# EAGLE board Flexboard (EAGLE 9.7.0), part 1 of 3
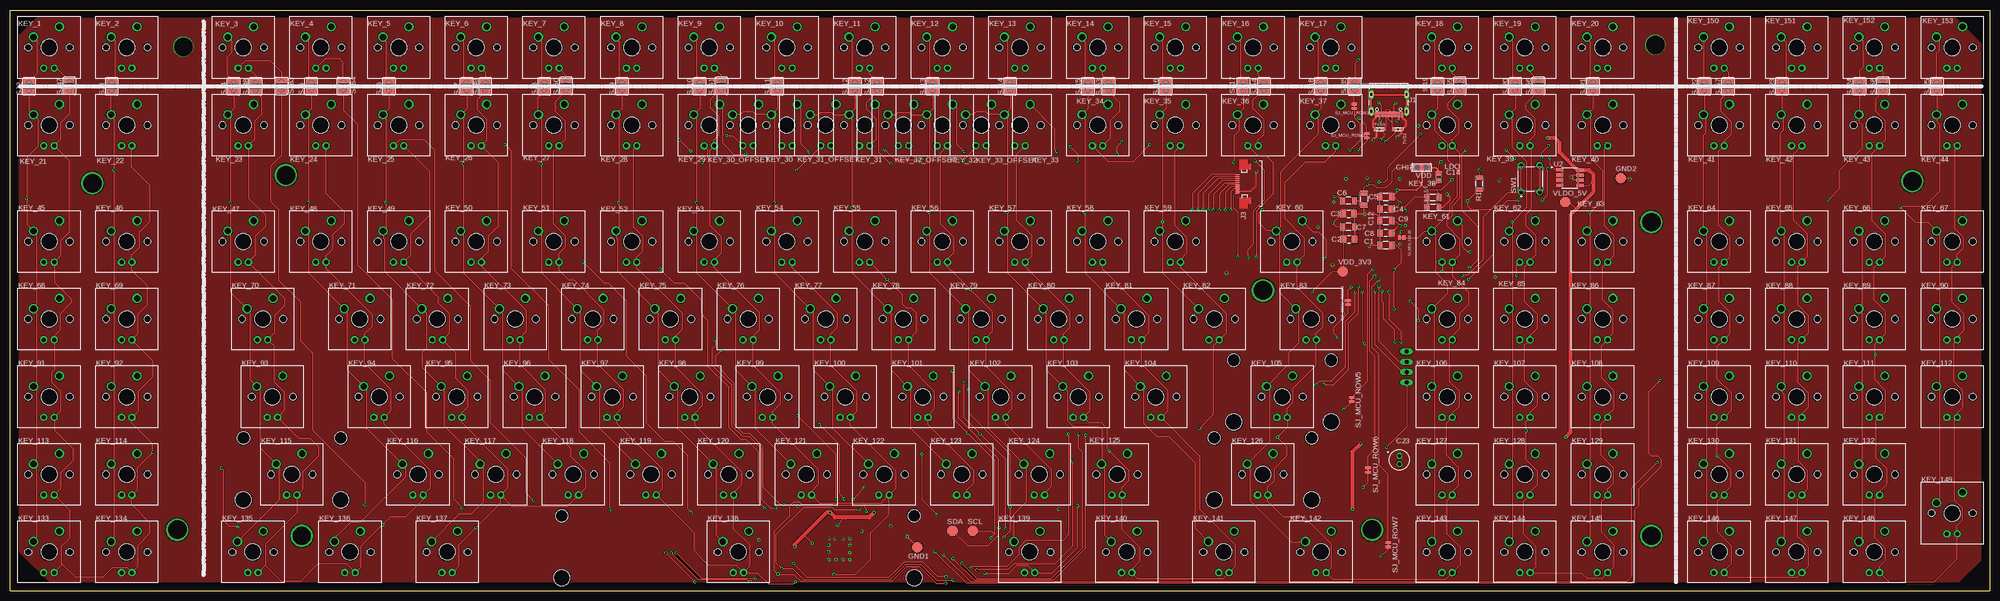
[diagram p6: board, top side]
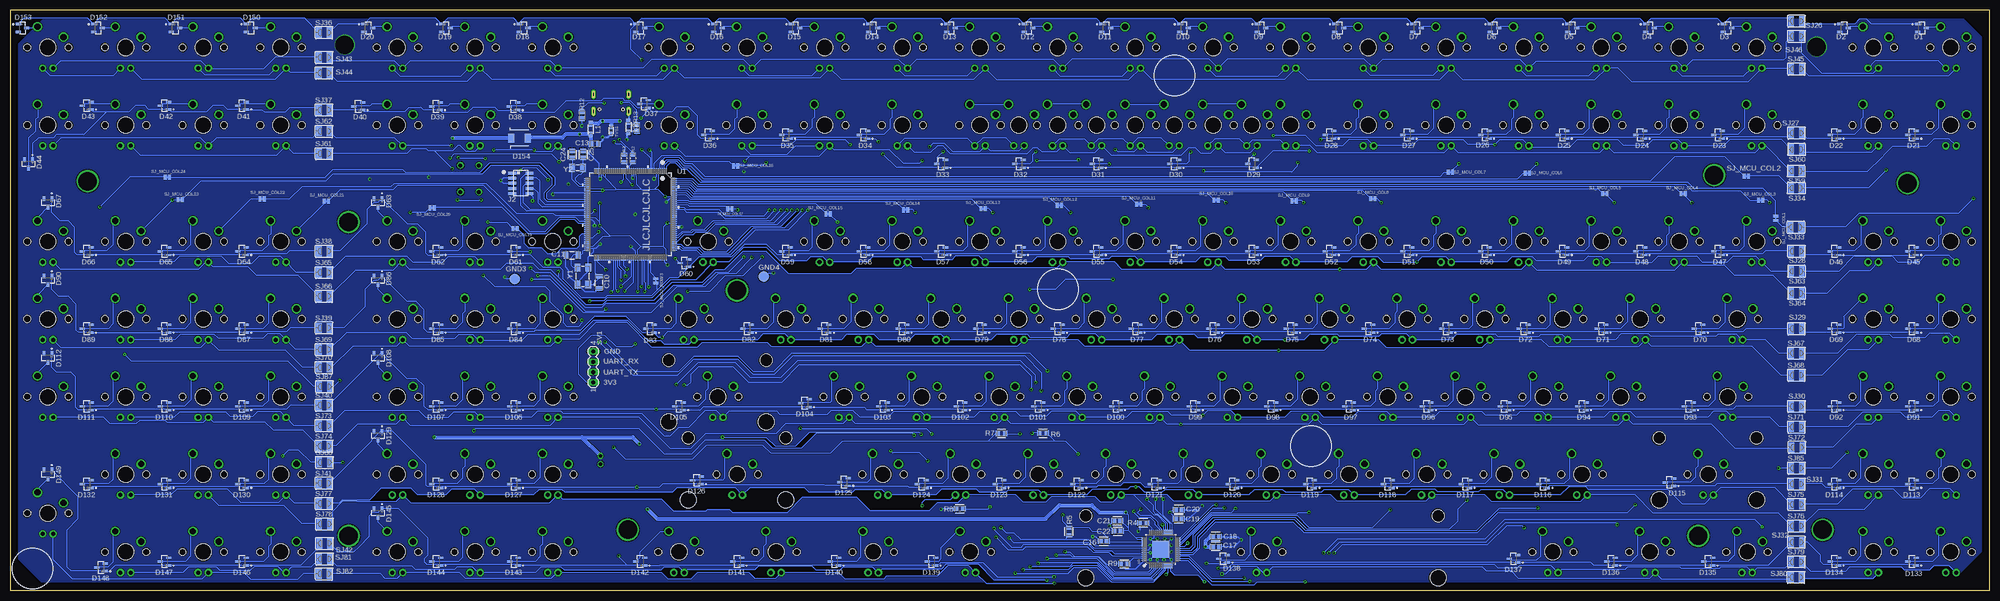
[diagram p7: board, bottom side, seen from below]

Size 485.5 x 142.5 mm. Coordinates in mm from the lower left corner, seen from the top.
Outline: 0,0 485.5,0 485.5,142.5 0,142.5 0,0
Copper layers (1*16): Top 0.035mm / dielectric 1.6mm / Bottom 0.035mm
Design rules "jlcpcb-2layers *": minimum track width 5mil, minimum drill 0.3mm, track to track 5mil, track to pad 0.2mm, pad to pad 0.5mm, via to via 0.5mm, smd to smd 5mil, copper to edge 10mil, drill to drill 6mil, minimum pad ring 0.3mm, minimum via ring 0.2mm, stop-mask expansion 4mil, vias tented up to drill 0mil, thermal gap 10mil
Holes 3.05 mm at 319.2,37.5 295.3,37.5 324,56.6 300.1,56.6 81.1,37.5 57.2,37.5 221.7,18.4 135.3,18.4
Holes 3.99 mm at 319.2,22.3 295.3,22.3 324,41.4 300.1,41.4 81.1,22.3 57.2,22.3 221.7,3.2 135.3,3.2

## Footprints (pad centres in the part's own frame; a part is rotated, then mirrored left to right if it is on the bottom)
CAPC3216X110N = smd 1.16 x 1.82: 1 -1.475,0; 2 1.475,0
CAPC3216X125N = smd 1.38 x 1.82: 1 -1.369,0; 2 1.369,0
CAPC3216X88N = smd 1.16 x 1.82: 1 -1.475,0; 2 1.475,0
CAPC3216X178N = smd 1.16 x 1.82: 1 -1.475,0; 2 1.475,0
CAPC2012X145N = smd 1.11 x 1.47: 1 -0.9,0; 2 0.9,0
CAPC2012X110 = smd 1.165 x 1.465: 1 -0.875,0; 2 0.875,0
860020672011 = drill 0.8 octagon: + 0,1; - 0,-1
SOT95P240X111-3N = smd 1.23 x 0.6: 1 -1.06,0.95; 2 -1.06,-0.95; 3 1.06,0
LSM115JE3/TR13 = smd 1.52 x 2.21: 1 -2.035,0; 2 2.035,0
B2,54 = smd 2.54 x 2.54: TP 0,0
PTH = drill 4.5 pad 5.2: HOLE 0,0
GCT_USB4105-GF-A = smd 0.6 x 1.25: A1_B12 -3.2,4.905; B1_A12 3.2,4.905 | smd 0.6 x 1.35: A4_B9 -2.4,4.855; B4_A9 2.4,4.855 | smd 0.3 x 1.35: A5 -1.25,4.855; A6 -0.25,4.855; A7 0.25,4.855; A8 1.25,4.855; B5 1.75,4.855; B6 0.75,4.855; B7 -0.75,4.855; B8 -1.75,4.855 | drill 0.66 pad 1.05 long: S1 -4.32,4.18; S4 4.32,4.18 | drill 0.66 pad 1 long: S2 -4.32,0; S3 4.32,0 | hole 0.65: 2.89,3.68; -2.89,3.68
DEBUG = smd 1.854 x 0.737: 1 -2.121,2.54; 2 2.121,2.54; 3 -2.121,1.27; 4 2.121,1.27; 5 -2.121,0; 6 2.121,0; 7 -2.121,-1.27; 8 2.121,-1.27; 9 -2.121,-2.54; 10 2.121,-2.54
52745-1033 = smd 0.3 x 0.8: 1 -2.25,0; 2 -1.75,0; 3 -1.25,0; 4 -0.75,0; 5 -0.25,0; 6 0.25,0; 7 0.75,0; 8 1.25,0; 9 1.75,0; 10 2.25,0
CHERRY-MX-LED = drill 0.991 pad 1.778: LED+ -1.27,-5.08; LED- 1.27,-5.08 | drill 1.499 pad 2.286: SW1 -3.81,2.54; SW2 2.54,5.08 | hole 3.988: 0,0 | hole 1.702: -5.08,0; 5.08,0
CHERRY-MX-LED-NOPIN = drill 1.016 pad 1.702: LED+ -1.27,-5.08; LED- 1.27,-5.08 | drill 1.499 pad 2.286: SW1 -3.81,2.54; SW2 2.54,5.08 | hole 3.988: 0,0
78285333 = smd 1.4 x 1: 1 -1.3,0; 2 1.3,0
RESC3115X65N = smd 1.05 x 1.72: 1 -1.46,0; 2 1.46,0
RESC2012X65N = smd 1 x 1.42: 1 -0.935,0; 2 0.935,0
RESC2012X65 = smd 1.031 x 1.42: 1 -0.919,0; 2 0.919,0
RESC2012X60N = smd 1.2 x 1.42: 1 -0.835,0; 2 0.835,0
SJ_2 = smd 1.168 x 1.6: 1 -1.524,0; 2 0,0; 3 1.524,0
SJW = smd 1.27 x 2.54: 1 -1.27,0; 2 1.27,0
SMT-JUMPER_2_NC_TRACE_NO-SILK = smd 0.66 x 1.27: 1 -0.521,0; 2 0.521,0
MA04-1 = drill 1.016 long: 1 -3.81,0; 2 -1.27,0; 3 1.27,0; 4 3.81,0
SW_1825910-7 = drill 0.99: 1 -3.25,2.25; 2 3.25,2.25; 3 -3.25,-2.25; 4 3.25,-2.25
0603ESDA2-TR2 = smd 1.1 x 1: 1 -0.85,0; 2 0.85,0
LQFP-144_20X20X1.6 = smd 1.461 x 0.27: 1 -10.498,8.75; 2 -10.498,8.25; 3 -10.498,7.75; 4 -10.498,7.25; 5 -10.498,6.75; 6 -10.498,6.25; 7 -10.498,5.75; 8 -10.498,5.25; 9 -10.498,4.75; 10 -10.498,4.25; 11 -10.498,3.75; 12 -10.498,3.25; 13 -10.498,2.75; 14 -10.498,2.25; 15 -10.498,1.75; 16 -10.498,1.25; 17 -10.498,0.75; 18 -10.498,0.25; 19 -10.498,-0.25; 20 -10.498,-0.75; 21 -10.498,-1.25; 22 -10.498,-1.75; 23 -10.498,-2.25; 24 -10.498,-2.75; 25 -10.498,-3.25; 26 -10.498,-3.75; 27 -10.498,-4.25; 28 -10.498,-4.75; 29 -10.498,-5.25; 30 -10.498,-5.75; 31 -10.498,-6.25; 32 -10.498,-6.75; 33 -10.498,-7.25; 34 -10.498,-7.75; 35 -10.498,-8.25; 36 -10.498,-8.75; 73 10.752,-8.75; 74 10.752,-8.25; 75 10.752,-7.75; 76 10.752,-7.25; 77 10.752,-6.75; 78 10.752,-6.25; 79 10.752,-5.75; 80 10.752,-5.25; 81 10.752,-4.75; 82 10.752,-4.25; 83 10.752,-3.75; 84 10.752,-3.25; 85 10.752,-2.75; 86 10.752,-2.25; 87 10.752,-1.75; 88 10.752,-1.25; 89 10.752,-0.75; 90 10.752,-0.25; 91 10.752,0.25; 92 10.752,0.75; 93 10.752,1.25; 94 10.752,1.75; 95 10.752,2.25; 96 10.752,2.75; 97 10.752,3.25; 98 10.752,3.75; 99 10.752,4.25; 100 10.752,4.75; 101 10.752,5.25; 102 10.752,5.75; 103 10.752,6.25; 104 10.752,6.75; 105 10.752,7.25; 106 10.752,7.75; 107 10.752,8.25; 108 10.752,8.75 | smd 0.27 x 1.461: 37 -8.623,-10.625; 38 -8.123,-10.625; 39 -7.623,-10.625; 40 -7.123,-10.625; 41 -6.623,-10.625; 42 -6.123,-10.625; 43 -5.623,-10.625; 44 -5.123,-10.625; 45 -4.623,-10.625; 46 -4.123,-10.625; 47 -3.623,-10.625; 48 -3.123,-10.625; 49 -2.623,-10.625; 50 -2.123,-10.625; 51 -1.623,-10.625; 52 -1.123,-10.625; 53 -0.623,-10.625; 54 -0.123,-10.625; 55 0.377,-10.625; 56 0.877,-10.625; 57 1.377,-10.625; 58 1.877,-10.625; 59 2.377,-10.625; 60 2.877,-10.625; 61 3.377,-10.625; 62 3.877,-10.625; 63 4.377,-10.625; 64 4.877,-10.625; 65 5.377,-10.625; 66 5.877,-10.625; 67 6.377,-10.625; 68 6.877,-10.625; 69 7.377,-10.625; 70 7.877,-10.625; 71 8.377,-10.625; 72 8.877,-10.625; 109 8.877,10.625; 110 8.377,10.625; 111 7.877,10.625; 112 7.377,10.625; 113 6.877,10.625; 114 6.377,10.625; 115 5.877,10.625; 116 5.377,10.625; 117 4.877,10.625; 118 4.377,10.625; 119 3.877,10.625; 120 3.377,10.625; 121 2.877,10.625; 122 2.377,10.625; 123 1.877,10.625; 124 1.377,10.625; 125 0.877,10.625; 126 0.377,10.625; 127 -0.123,10.625; 128 -0.623,10.625; 129 -1.123,10.625; 130 -1.623,10.625; 131 -2.123,10.625; 132 -2.623,10.625; 133 -3.123,10.625; 134 -3.623,10.625; 135 -4.123,10.625; 136 -4.623,10.625; 137 -5.123,10.625; 138 -5.623,10.625; 139 -6.123,10.625; 140 -6.623,10.625; 141 -7.123,10.625; 142 -7.623,10.625; 143 -8.123,10.625; 144 -8.623,10.625
SOIC127P600X175-8N = smd 1.95 x 0.59: 1 -2.48,1.905; 2 -2.48,0.635; 3 -2.48,-0.635; 4 -2.48,-1.905; 5 2.48,-1.905; 6 2.48,-0.635; 7 2.48,0.635; 8 2.48,1.905
IS31FL3733B-TQLS4 = smd 1.17 x 0.3: 1 -4.12,2.75; 2 -4.12,2.25; 3 -4.12,1.75; 4 -4.12,1.25; 5 -4.12,0.75; 6 -4.12,0.25; 7 -4.12,-0.25; 8 -4.12,-0.75; 9 -4.12,-1.25; 10 -4.12,-1.75; 11 -4.12,-2.25; 12 -4.12,-2.75; 25 4.12,-2.75; 26 4.12,-2.25; 27 4.12,-1.75; 28 4.12,-1.25; 29 4.12,-0.75; 30 4.12,-0.25; 31 4.12,0.25; 32 4.12,0.75; 33 4.12,1.25; 34 4.12,1.75; 35 4.12,2.25; 36 4.12,2.75 | smd 0.3 x 1.17: 13 -2.75,-4.12; 14 -2.25,-4.12; 15 -1.75,-4.12; 16 -1.25,-4.12; 17 -0.75,-4.12; 18 -0.25,-4.12; 19 0.25,-4.12; 20 0.75,-4.12; 21 1.25,-4.12; 22 1.75,-4.12; 23 2.25,-4.12; 24 2.75,-4.12; 37 2.75,4.12; 38 2.25,4.12; 39 1.75,4.12; 40 1.25,4.12; 41 0.75,4.12; 42 0.25,4.12; 43 -0.25,4.12; 44 -0.75,4.12; 45 -1.25,4.12; 46 -1.75,4.12; 47 -2.25,4.12; 48 -2.75,4.12 | smd 4.11 x 4.11: PAD 0,0
OSC_ABM3B-8.000MHZ-B2-T = smd 1.4 x 2: 1 -1.3,2.1; 2 -1.3,-2.1; 3 1.3,-2.1; 4 1.3,2.1
XTAL_ABS07-32.768KHZ-T = smd 1.3 x 2.1: 1 -1.35,0; 2 1.35,0

## Placement (x,y rotation side)
C1  1000pF  [CAPC3216X110N]  337.36,84.83 180 top
C2  1uF  [CAPC3216X125N]  328.34,86.29 0 top
C3  1uF  [CAPC3216X125N]  328.24,92.55 0 top
C4  1uF  [CAPC3216X125N]  337.36,93.74 180 top
C5  100nF  [CAPC3216X88N]  337.36,96.71 0 top
C6  100nF  [CAPC3216X88N]  328.23,95.75 180 top
C7  100nF  [CAPC3216X88N]  328.24,89.31 180 top
C8  1uF  [CAPC3216X125N]  337.36,87.79 180 top
C9  100nF  [CAPC3216X88N]  337.36,90.76 0 top
C10  22pF  [CAPC3216X110N]  341.12,75.7 90 bottom
C11  22pF  [CAPC3216X110N]  347.69,82.35 0 bottom
C12  2.2uF  [CAPC3216X178N]  332.01,96.14 270 top
C13  10uF  [CAPC2012X145N]  342.12,109.61 0 bottom
C14  10uF  [CAPC2012X145N]  350.41,101.53 270 top
C15  1000pF  [CAPC3216X110N]  348.96,94.05 0 top
C16  0.47uF  [CAPC2012X110]  217.3,12.2 180 bottom
C17  0.47uF  [CAPC2012X110]  189.8,10.8 0 bottom
C18  0.1uF  [CAPC2012X110]  189.8,13.3 0 bottom
C19  0.47uF  [CAPC2012X110]  198.9,17.6 0 bottom
C20  0.1uF  [CAPC2012X110]  198.9,19.9 0 bottom
C21  0.47uF  [CAPC2012X110]  214,17.2 180 bottom
C22  0.1uF  [CAPC2012X110]  213.9,14.7 180 bottom
C23  22uF  [860020672011]  340.7,32.1 0 top
C24  12pF  [CAPC2012X110]  347.7,107.1 90 bottom
C25  12pF  [CAPC2012X110]  344.99,107.1 90 bottom
D1  BAS16LT3G  [SOT95P240X111-3N]  16.67,138.11 0 bottom
D2  BAS16LT3G  [SOT95P240X111-3N]  35.72,138.11 0 bottom
D3  BAS16LT3G  [SOT95P240X111-3N]  64.29,138.11 0 bottom
D4  BAS16LT3G  [SOT95P240X111-3N]  83.34,138.11 0 bottom
D5  BAS16LT3G  [SOT95P240X111-3N]  102.39,138.11 0 bottom
D6  BAS16LT3G  [SOT95P240X111-3N]  121.44,138.11 0 bottom
D7  BAS16LT3G  [SOT95P240X111-3N]  140.49,138.11 0 bottom
D8  BAS16LT3G  [SOT95P240X111-3N]  159.54,138.11 0 bottom
D9  BAS16LT3G  [SOT95P240X111-3N]  178.59,138.11 0 bottom
D10  BAS16LT3G  [SOT95P240X111-3N]  197.64,138.11 0 bottom
D11  BAS16LT3G  [SOT95P240X111-3N]  216.69,138.11 0 bottom
D12  BAS16LT3G  [SOT95P240X111-3N]  235.74,138.11 0 bottom
D13  BAS16LT3G  [SOT95P240X111-3N]  254.79,138.11 0 bottom
D14  BAS16LT3G  [SOT95P240X111-3N]  273.84,138.11 0 bottom
D15  BAS16LT3G  [SOT95P240X111-3N]  292.89,138.11 0 bottom
D16  BAS16LT3G  [SOT95P240X111-3N]  311.94,138.11 0 bottom
D17  BAS16LT3G  [SOT95P240X111-3N]  330.99,138.11 0 bottom
D18  BAS16LT3G  [SOT95P240X111-3N]  359.57,138.11 0 bottom
D19  BAS16LT3G  [SOT95P240X111-3N]  378.62,138.11 0 bottom
D20  BAS16LT3G  [SOT95P240X111-3N]  397.67,138.11 0 bottom
D21  BAS16LT3G  [SOT95P240X111-3N]  19.05,111.92 180 bottom
D22  BAS16LT3G  [SOT95P240X111-3N]  38.1,111.92 180 bottom
D23  BAS16LT3G  [SOT95P240X111-3N]  66.67,111.92 180 bottom
D24  BAS16LT3G  [SOT95P240X111-3N]  85.72,111.92 180 bottom
D25  BAS16LT3G  [SOT95P240X111-3N]  104.78,111.92 180 bottom
D26  BAS16LT3G  [SOT95P240X111-3N]  123.83,111.92 180 bottom
D27  BAS16LT3G  [SOT95P240X111-3N]  142.88,111.92 180 bottom
D28  BAS16LT3G  [SOT95P240X111-3N]  161.93,111.92 180 bottom
D29  BAS16LT3G  [SOT95P240X111-3N]  180.97,104.78 180 bottom
D30  BAS16LT3G  [SOT95P240X111-3N]  200.03,104.78 180 bottom
D31  BAS16LT3G  [SOT95P240X111-3N]  219.07,104.78 180 bottom
D32  BAS16LT3G  [SOT95P240X111-3N]  238.12,104.78 180 bottom
D33  BAS16LT3G  [SOT95P240X111-3N]  257.18,104.78 180 bottom
D34  BAS16LT3G  [SOT95P240X111-3N]  276.23,111.92 180 bottom
D35  BAS16LT3G  [SOT95P240X111-3N]  295.27,111.92 180 bottom
D36  BAS16LT3G  [SOT95P240X111-3N]  314.32,111.92 180 bottom
D37  BAS16LT3G  [SOT95P240X111-3N]  330.07,119.46 180 bottom
D38  BAS16LT3G  [SOT95P240X111-3N]  362.05,118.92 180 bottom
D39  BAS16LT3G  [SOT95P240X111-3N]  381.1,118.92 180 bottom
D40  BAS16LT3G  [SOT95P240X111-3N]  400.15,118.92 180 bottom
D41  BAS16LT3G  [SOT95P240X111-3N]  428.62,119.06 180 bottom
D42  BAS16LT3G  [SOT95P240X111-3N]  447.68,119.06 180 bottom
D43  BAS16LT3G  [SOT95P240X111-3N]  466.73,119.06 180 bottom
D44  BAS16LT3G  [SOT95P240X111-3N]  481.01,104.78 270 bottom
D45  BAS16LT3G  [SOT95P240X111-3N]  19.05,83.34 180 bottom
D46  BAS16LT3G  [SOT95P240X111-3N]  38.1,83.34 180 bottom
D47  BAS16LT3G  [SOT95P240X111-3N]  66.67,83.34 180 bottom
D48  BAS16LT3G  [SOT95P240X111-3N]  85.72,83.34 180 bottom
D49  BAS16LT3G  [SOT95P240X111-3N]  104.78,83.34 180 bottom
D50  BAS16LT3G  [SOT95P240X111-3N]  123.83,83.34 180 bottom
D51  BAS16LT3G  [SOT95P240X111-3N]  142.88,83.34 180 bottom
D52  BAS16LT3G  [SOT95P240X111-3N]  161.93,83.34 180 bottom
D53  BAS16LT3G  [SOT95P240X111-3N]  180.97,83.34 180 bottom
D54  BAS16LT3G  [SOT95P240X111-3N]  200.03,83.34 180 bottom
D55  BAS16LT3G  [SOT95P240X111-3N]  219.07,83.34 180 bottom
D56  BAS16LT3G  [SOT95P240X111-3N]  238.12,83.34 180 bottom
D57  BAS16LT3G  [SOT95P240X111-3N]  257.18,83.34 180 bottom
D58  BAS16LT3G  [SOT95P240X111-3N]  276.23,83.34 180 bottom
D59  BAS16LT3G  [SOT95P240X111-3N]  295.27,83.34 180 bottom
D60  BAS16LT3G  [SOT95P240X111-3N]  320.15,80.44 180 bottom
D61  BAS16LT3G  [SOT95P240X111-3N]  361.95,83.34 180 bottom
D62  BAS16LT3G  [SOT95P240X111-3N]  381,83.34 180 bottom
D63  BAS16LT3G  [SOT95P240X111-3N]  395.29,95.25 270 bottom
D64  BAS16LT3G  [SOT95P240X111-3N]  428.62,83.34 180 bottom
D65  BAS16LT3G  [SOT95P240X111-3N]  447.68,83.34 180 bottom
D66  BAS16LT3G  [SOT95P240X111-3N]  466.73,83.34 180 bottom
D67  BAS16LT3G  [SOT95P240X111-3N]  476.25,95.25 270 bottom
D68  BAS16LT3G  [SOT95P240X111-3N]  19.05,64.29 180 bottom
D69  BAS16LT3G  [SOT95P240X111-3N]  38.1,64.29 180 bottom
D70  BAS16LT3G  [SOT95P240X111-3N]  71.44,64.29 180 bottom
D71  BAS16LT3G  [SOT95P240X111-3N]  95.25,64.29 180 bottom
D72  BAS16LT3G  [SOT95P240X111-3N]  114.3,64.29 180 bottom
D73  BAS16LT3G  [SOT95P240X111-3N]  133.35,64.29 180 bottom
D74  BAS16LT3G  [SOT95P240X111-3N]  152.4,64.29 180 bottom
D75  BAS16LT3G  [SOT95P240X111-3N]  171.45,64.29 180 bottom
D76  BAS16LT3G  [SOT95P240X111-3N]  190.5,64.29 180 bottom
D77  BAS16LT3G  [SOT95P240X111-3N]  209.55,64.29 180 bottom
D78  BAS16LT3G  [SOT95P240X111-3N]  228.6,64.29 180 bottom
D79  BAS16LT3G  [SOT95P240X111-3N]  247.65,64.29 180 bottom
D80  BAS16LT3G  [SOT95P240X111-3N]  266.7,64.29 180 bottom
D81  BAS16LT3G  [SOT95P240X111-3N]  285.75,64.29 180 bottom
D82  BAS16LT3G  [SOT95P240X111-3N]  304.8,64.29 180 bottom
D83  BAS16LT3G  [SOT95P240X111-3N]  328.61,64.29 180 bottom
D84  BAS16LT3G  [SOT95P240X111-3N]  361.95,64.29 180 bottom
D85  BAS16LT3G  [SOT95P240X111-3N]  381,64.29 180 bottom
D86  BAS16LT3G  [SOT95P240X111-3N]  395.29,76.2 270 bottom
D87  BAS16LT3G  [SOT95P240X111-3N]  428.62,64.29 180 bottom
D88  BAS16LT3G  [SOT95P240X111-3N]  447.68,64.29 180 bottom
D89  BAS16LT3G  [SOT95P240X111-3N]  466.73,64.29 180 bottom
D90  BAS16LT3G  [SOT95P240X111-3N]  476.25,76.2 270 bottom
D91  BAS16LT3G  [SOT95P240X111-3N]  19.05,45.24 180 bottom
D92  BAS16LT3G  [SOT95P240X111-3N]  38.1,45.24 180 bottom
D93  BAS16LT3G  [SOT95P240X111-3N]  73.82,45.24 180 bottom
D94  BAS16LT3G  [SOT95P240X111-3N]  100.01,45.24 180 bottom
D95  BAS16LT3G  [SOT95P240X111-3N]  119.06,45.24 180 bottom
D96  BAS16LT3G  [SOT95P240X111-3N]  138.11,45.24 180 bottom
D97  BAS16LT3G  [SOT95P240X111-3N]  157.16,45.24 180 bottom
D98  BAS16LT3G  [SOT95P240X111-3N]  176.21,45.24 180 bottom
D99  BAS16LT3G  [SOT95P240X111-3N]  195.26,45.24 180 bottom
D100  BAS16LT3G  [SOT95P240X111-3N]  214.31,45.24 180 bottom
D101  BAS16LT3G  [SOT95P240X111-3N]  233.36,45.24 180 bottom
D102  BAS16LT3G  [SOT95P240X111-3N]  252.41,45.24 180 bottom
D103  BAS16LT3G  [SOT95P240X111-3N]  271.46,45.24 180 bottom
D104  BAS16LT3G  [SOT95P240X111-3N]  290.61,46.04 180 bottom
D105  BAS16LT3G  [SOT95P240X111-3N]  321.47,45.24 180 bottom
D106  BAS16LT3G  [SOT95P240X111-3N]  361.95,45.24 180 bottom
D107  BAS16LT3G  [SOT95P240X111-3N]  381,45.24 180 bottom
D108  BAS16LT3G  [SOT95P240X111-3N]  395.29,57.15 270 bottom
D109  BAS16LT3G  [SOT95P240X111-3N]  428.62,45.24 180 bottom
D110  BAS16LT3G  [SOT95P240X111-3N]  447.68,45.24 180 bottom
D111  BAS16LT3G  [SOT95P240X111-3N]  466.73,45.24 180 bottom
D112  BAS16LT3G  [SOT95P240X111-3N]  476.25,57.15 270 bottom
D113  BAS16LT3G  [SOT95P240X111-3N]  19.05,26.19 180 bottom
D114  BAS16LT3G  [SOT95P240X111-3N]  38.1,26.19 180 bottom
D115  BAS16LT3G  [SOT95P240X111-3N]  78.58,26.59 180 bottom
D116  BAS16LT3G  [SOT95P240X111-3N]  109.54,26.19 180 bottom
D117  BAS16LT3G  [SOT95P240X111-3N]  128.59,26.19 180 bottom
D118  BAS16LT3G  [SOT95P240X111-3N]  147.64,26.19 180 bottom
D119  BAS16LT3G  [SOT95P240X111-3N]  166.69,26.19 180 bottom
D120  BAS16LT3G  [SOT95P240X111-3N]  185.74,26.19 180 bottom
D121  BAS16LT3G  [SOT95P240X111-3N]  204.79,26.19 180 bottom
D122  BAS16LT3G  [SOT95P240X111-3N]  223.84,26.19 180 bottom
D123  BAS16LT3G  [SOT95P240X111-3N]  242.89,26.19 180 bottom
D124  BAS16LT3G  [SOT95P240X111-3N]  261.94,26.19 180 bottom
D125  BAS16LT3G  [SOT95P240X111-3N]  280.99,26.69 180 bottom
D126  BAS16LT3G  [SOT95P240X111-3N]  317.11,27.09 180 bottom
D127  BAS16LT3G  [SOT95P240X111-3N]  361.95,26.19 180 bottom
D128  BAS16LT3G  [SOT95P240X111-3N]  381,26.19 180 bottom
D129  BAS16LT3G  [SOT95P240X111-3N]  395.29,38.1 270 bottom
D130  BAS16LT3G  [SOT95P240X111-3N]  428.62,26.19 180 bottom
D131  BAS16LT3G  [SOT95P240X111-3N]  447.68,26.19 180 bottom
D132  BAS16LT3G  [SOT95P240X111-3N]  466.73,26.19 180 bottom
D133  BAS16LT3G  [SOT95P240X111-3N]  19.05,7.14 180 bottom
D134  BAS16LT3G  [SOT95P240X111-3N]  38.1,7.14 180 bottom
D135  BAS16LT3G  [SOT95P240X111-3N]  69.06,7.14 180 bottom
D136  BAS16LT3G  [SOT95P240X111-3N]  92.87,7.14 180 bottom
D137  BAS16LT3G  [SOT95P240X111-3N]  116.78,7.84 180 bottom
D138  BAS16LT3G  [SOT95P240X111-3N]  188.02,7.84 180 bottom
D139  BAS16LT3G  [SOT95P240X111-3N]  259.56,7.14 180 bottom
D140  BAS16LT3G  [SOT95P240X111-3N]  283.37,7.14 180 bottom
D141  BAS16LT3G  [SOT95P240X111-3N]  307.18,7.14 180 bottom
D142  BAS16LT3G  [SOT95P240X111-3N]  330.99,7.14 180 bottom
D143  BAS16LT3G  [SOT95P240X111-3N]  361.95,7.14 180 bottom
D144  BAS16LT3G  [SOT95P240X111-3N]  381,7.14 180 bottom
D145  BAS16LT3G  [SOT95P240X111-3N]  395.29,19.05 270 bottom
D146  BAS16LT3G  [SOT95P240X111-3N]  428.62,7.14 180 bottom
D147  BAS16LT3G  [SOT95P240X111-3N]  447.68,7.14 180 bottom
D148  BAS16LT3G  [SOT95P240X111-3N]  463.23,5.74 180 bottom
D149  BAS16LT3G  [SOT95P240X111-3N]  476.25,28.57 270 bottom
D150  BAS16LT3G  [SOT95P240X111-3N]  426.5,138.11 0 bottom
D151  BAS16LT3G  [SOT95P240X111-3N]  445,138.11 0 bottom
D152  BAS16LT3G  [SOT95P240X111-3N]  464,138.11 0 bottom
D153  BAS16LT3G  [SOT95P240X111-3N]  482.5,138.11 0 bottom
D154  LSM115JE3/TR13  [LSM115JE3/TR13]  360.6,111.1 180 bottom
GND1  TPB2,54  [B2,54]  222.5,10.7 0 top
GND2  TPB2,54  [B2,54]  395,101.3 0 top
GND3  TPB2,54  [B2,54]  361.8,76.5 0 bottom
GND4  TPB2,54  [B2,54]  300.7,77.1 0 bottom
H1  PTH  [PTH]  402.5,13.5 0 top
H2  PTH  [PTH]  41,15 0 top
H3  PTH  [PTH]  20.14,100.01 0 top
H4  PTH  [PTH]  67.6,102 0 top
H5  PTH  [PTH]  71.5,13.5 0 top
H6  PTH  [PTH]  334,15 0 top
H7  PTH  [PTH]  402.5,90.5 0 top
H8  PTH  [PTH]  466.5,100.5 0 top
H9  PTH  [PTH]  307.25,73.75 0 top
J1  USB4105-GF-A  [GCT_USB4105-GF-A]  338.14,121.82 180 top
J2  GRPB052VWQS-RC  [DEBUG]  360.24,100.03 0 bottom
J3  0527451033  [52745-1033]  301,99.9 90 top
KEY_1  CHERRY-MX-LED  [CHERRY-MX-LED]  9.53,133.35 0 top
KEY_2  CHERRY-MX-LED  [CHERRY-MX-LED]  28.57,133.35 0 top
KEY_3  CHERRY-MX-LED  [CHERRY-MX-LED]  57.15,133.35 0 top
KEY_4  CHERRY-MX-LED  [CHERRY-MX-LED]  76.2,133.35 0 top
KEY_5  CHERRY-MX-LED  [CHERRY-MX-LED]  95.25,133.35 0 top
KEY_6  CHERRY-MX-LED  [CHERRY-MX-LED]  114.3,133.35 0 top
KEY_7  CHERRY-MX-LED  [CHERRY-MX-LED]  133.35,133.35 0 top
KEY_8  CHERRY-MX-LED  [CHERRY-MX-LED]  152.4,133.35 0 top
KEY_9  CHERRY-MX-LED  [CHERRY-MX-LED]  171.45,133.35 0 top
KEY_10  CHERRY-MX-LED  [CHERRY-MX-LED]  190.5,133.35 0 top
KEY_11  CHERRY-MX-LED  [CHERRY-MX-LED]  209.55,133.35 0 top
KEY_12  CHERRY-MX-LED  [CHERRY-MX-LED]  228.6,133.35 0 top
KEY_13  CHERRY-MX-LED  [CHERRY-MX-LED]  247.65,133.35 0 top
KEY_14  CHERRY-MX-LED  [CHERRY-MX-LED]  266.7,133.35 0 top
KEY_15  CHERRY-MX-LED  [CHERRY-MX-LED]  285.75,133.35 0 top
KEY_16  CHERRY-MX-LED  [CHERRY-MX-LED]  304.8,133.35 0 top
KEY_17  CHERRY-MX-LED  [CHERRY-MX-LED]  323.85,133.35 0 top
KEY_18  CHERRY-MX-LED  [CHERRY-MX-LED]  352.43,133.35 0 top
KEY_19  CHERRY-MX-LED  [CHERRY-MX-LED]  371.48,133.35 0 top
KEY_20  CHERRY-MX-LED  [CHERRY-MX-LED]  390.52,133.35 0 top
KEY_21  CHERRY-MX-LED  [CHERRY-MX-LED]  9.53,114.3 0 top
KEY_22  CHERRY-MX-LED  [CHERRY-MX-LED]  28.57,114.3 0 top
KEY_23  CHERRY-MX-LED  [CHERRY-MX-LED]  57.15,114.3 0 top
KEY_24  CHERRY-MX-LED  [CHERRY-MX-LED]  76.2,114.3 0 top
KEY_25  CHERRY-MX-LED  [CHERRY-MX-LED]  95.25,114.3 0 top
KEY_26  CHERRY-MX-LED  [CHERRY-MX-LED]  114.3,114.3 0 top
KEY_27  CHERRY-MX-LED  [CHERRY-MX-LED]  133.35,114.3 0 top
KEY_28  CHERRY-MX-LED  [CHERRY-MX-LED]  152.4,114.3 0 top
KEY_29  CHERRY-MX-LED  [CHERRY-MX-LED]  171.45,114.3 0 top
KEY_30  CHERRY-MX-LED  [CHERRY-MX-LED]  190.5,114.3 0 top
KEY_30_OFFSET  CHERRY-MX-LED-NOPIN  [CHERRY-MX-LED-NOPIN]  180.97,114.3 0 top
KEY_31  CHERRY-MX-LED  [CHERRY-MX-LED]  209.55,114.3 0 top
KEY_31_OFFSET  CHERRY-MX-LED-NOPIN  [CHERRY-MX-LED-NOPIN]  200.03,114.3 0 top
KEY_32  CHERRY-MX-LED  [CHERRY-MX-LED]  228.6,114.3 0 top
KEY_32_OFFSET  CHERRY-MX-LED-NOPIN  [CHERRY-MX-LED-NOPIN]  219.07,114.3 0 top
KEY_33  CHERRY-MX-LED  [CHERRY-MX-LED]  247.65,114.3 0 top
KEY_33_OFFSET  CHERRY-MX-LED-NOPIN  [CHERRY-MX-LED-NOPIN]  238.12,114.3 0 top
KEY_34  CHERRY-MX-LED  [CHERRY-MX-LED]  266.7,114.3 0 top
KEY_35  CHERRY-MX-LED  [CHERRY-MX-LED]  285.75,114.3 0 top
KEY_36  CHERRY-MX-LED  [CHERRY-MX-LED]  304.8,114.3 0 top
KEY_37  CHERRY-MX-LED  [CHERRY-MX-LED]  323.85,114.3 0 top
KEY_38  CHERRY-MX-LED  [CHERRY-MX-LED]  352.43,114.3 0 top
KEY_39  CHERRY-MX-LED  [CHERRY-MX-LED]  371.48,114.3 0 top
KEY_40  CHERRY-MX-LED  [CHERRY-MX-LED]  390.52,114.3 0 top
KEY_41  CHERRY-MX-LED  [CHERRY-MX-LED]  419.1,114.3 0 top
KEY_42  CHERRY-MX-LED  [CHERRY-MX-LED]  438.15,114.3 0 top
KEY_43  CHERRY-MX-LED  [CHERRY-MX-LED]  457.2,114.3 0 top
KEY_44  CHERRY-MX-LED  [CHERRY-MX-LED]  476.25,114.3 0 top
KEY_45  CHERRY-MX-LED  [CHERRY-MX-LED]  9.53,85.72 0 top
KEY_46  CHERRY-MX-LED  [CHERRY-MX-LED]  28.57,85.72 0 top
KEY_47  CHERRY-MX-LED  [CHERRY-MX-LED]  57.15,85.72 0 top
KEY_48  CHERRY-MX-LED  [CHERRY-MX-LED]  76.2,85.72 0 top
KEY_49  CHERRY-MX-LED  [CHERRY-MX-LED]  95.25,85.72 0 top
KEY_50  CHERRY-MX-LED  [CHERRY-MX-LED]  114.3,85.72 0 top
KEY_51  CHERRY-MX-LED  [CHERRY-MX-LED]  133.35,85.72 0 top
KEY_52  CHERRY-MX-LED  [CHERRY-MX-LED]  152.4,85.72 0 top
KEY_53  CHERRY-MX-LED  [CHERRY-MX-LED]  171.45,85.72 0 top
KEY_54  CHERRY-MX-LED  [CHERRY-MX-LED]  190.5,85.72 0 top
KEY_55  CHERRY-MX-LED  [CHERRY-MX-LED]  209.55,85.72 0 top
KEY_56  CHERRY-MX-LED  [CHERRY-MX-LED]  228.6,85.72 0 top
KEY_57  CHERRY-MX-LED  [CHERRY-MX-LED]  247.65,85.72 0 top
KEY_58  CHERRY-MX-LED  [CHERRY-MX-LED]  266.7,85.72 0 top
KEY_59  CHERRY-MX-LED  [CHERRY-MX-LED]  285.75,85.72 0 top
KEY_60  CHERRY-MX-LED  [CHERRY-MX-LED]  314.32,85.72 0 top
KEY_61  CHERRY-MX-LED  [CHERRY-MX-LED]  352.43,85.72 0 top
KEY_62  CHERRY-MX-LED  [CHERRY-MX-LED]  371.48,85.72 0 top
KEY_63  CHERRY-MX-LED  [CHERRY-MX-LED]  390.52,85.72 0 top
KEY_64  CHERRY-MX-LED  [CHERRY-MX-LED]  419.1,85.72 0 top
KEY_65  CHERRY-MX-LED  [CHERRY-MX-LED]  438.15,85.72 0 top
KEY_66  CHERRY-MX-LED  [CHERRY-MX-LED]  457.2,85.72 0 top
KEY_67  CHERRY-MX-LED  [CHERRY-MX-LED]  476.25,85.72 0 top
KEY_68  CHERRY-MX-LED  [CHERRY-MX-LED]  9.53,66.67 0 top
KEY_69  CHERRY-MX-LED  [CHERRY-MX-LED]  28.57,66.67 0 top
KEY_70  CHERRY-MX-LED  [CHERRY-MX-LED]  61.91,66.67 0 top
KEY_71  CHERRY-MX-LED  [CHERRY-MX-LED]  85.72,66.67 0 top
KEY_72  CHERRY-MX-LED  [CHERRY-MX-LED]  104.78,66.67 0 top
KEY_73  CHERRY-MX-LED  [CHERRY-MX-LED]  123.83,66.67 0 top
KEY_74  CHERRY-MX-LED  [CHERRY-MX-LED]  142.88,66.67 0 top
KEY_75  CHERRY-MX-LED  [CHERRY-MX-LED]  161.93,66.67 0 top
KEY_76  CHERRY-MX-LED  [CHERRY-MX-LED]  180.97,66.67 0 top
KEY_77  CHERRY-MX-LED  [CHERRY-MX-LED]  200.03,66.67 0 top
KEY_78  CHERRY-MX-LED  [CHERRY-MX-LED]  219.07,66.67 0 top
KEY_79  CHERRY-MX-LED  [CHERRY-MX-LED]  238.12,66.67 0 top
KEY_80  CHERRY-MX-LED  [CHERRY-MX-LED]  257.18,66.67 0 top
KEY_81  CHERRY-MX-LED  [CHERRY-MX-LED]  276.23,66.67 0 top
KEY_82  CHERRY-MX-LED  [CHERRY-MX-LED]  295.27,66.67 0 top
KEY_83  CHERRY-MX-LED  [CHERRY-MX-LED]  319.09,66.67 0 top
KEY_84  CHERRY-MX-LED  [CHERRY-MX-LED]  352.43,66.67 0 top
KEY_85  CHERRY-MX-LED  [CHERRY-MX-LED]  371.48,66.67 0 top
KEY_86  CHERRY-MX-LED  [CHERRY-MX-LED]  390.52,66.67 0 top
KEY_87  CHERRY-MX-LED  [CHERRY-MX-LED]  419.1,66.67 0 top
KEY_88  CHERRY-MX-LED  [CHERRY-MX-LED]  438.15,66.67 0 top
KEY_89  CHERRY-MX-LED  [CHERRY-MX-LED]  457.2,66.67 0 top
KEY_90  CHERRY-MX-LED  [CHERRY-MX-LED]  476.25,66.67 0 top
KEY_91  CHERRY-MX-LED  [CHERRY-MX-LED]  9.53,47.62 0 top
KEY_92  CHERRY-MX-LED  [CHERRY-MX-LED]  28.57,47.62 0 top
KEY_93  CHERRY-MX-LED  [CHERRY-MX-LED]  64.29,47.62 0 top
KEY_94  CHERRY-MX-LED  [CHERRY-MX-LED]  90.49,47.62 0 top
KEY_95  CHERRY-MX-LED  [CHERRY-MX-LED]  109.54,47.62 0 top
KEY_96  CHERRY-MX-LED  [CHERRY-MX-LED]  128.59,47.62 0 top
KEY_97  CHERRY-MX-LED  [CHERRY-MX-LED]  147.64,47.62 0 top
KEY_98  CHERRY-MX-LED  [CHERRY-MX-LED]  166.69,47.62 0 top
KEY_99  CHERRY-MX-LED  [CHERRY-MX-LED]  185.74,47.62 0 top
KEY_100  CHERRY-MX-LED  [CHERRY-MX-LED]  204.79,47.62 0 top
KEY_101  CHERRY-MX-LED  [CHERRY-MX-LED]  223.84,47.62 0 top
KEY_102  CHERRY-MX-LED  [CHERRY-MX-LED]  242.89,47.62 0 top
KEY_103  CHERRY-MX-LED  [CHERRY-MX-LED]  261.94,47.62 0 top
KEY_104  CHERRY-MX-LED  [CHERRY-MX-LED]  280.99,47.62 0 top
KEY_105  CHERRY-MX-LED  [CHERRY-MX-LED]  311.94,47.62 0 top
KEY_106  CHERRY-MX-LED  [CHERRY-MX-LED]  352.43,47.62 0 top
KEY_107  CHERRY-MX-LED  [CHERRY-MX-LED]  371.48,47.62 0 top
KEY_108  CHERRY-MX-LED  [CHERRY-MX-LED]  390.52,47.62 0 top
KEY_109  CHERRY-MX-LED  [CHERRY-MX-LED]  419.1,47.62 0 top
KEY_110  CHERRY-MX-LED  [CHERRY-MX-LED]  438.15,47.62 0 top
KEY_111  CHERRY-MX-LED  [CHERRY-MX-LED]  457.2,47.62 0 top
KEY_112  CHERRY-MX-LED  [CHERRY-MX-LED]  476.25,47.62 0 top
KEY_113  CHERRY-MX-LED  [CHERRY-MX-LED]  9.53,28.57 0 top
KEY_114  CHERRY-MX-LED  [CHERRY-MX-LED]  28.57,28.57 0 top
KEY_115  CHERRY-MX-LED  [CHERRY-MX-LED]  69.06,28.57 0 top
KEY_116  CHERRY-MX-LED  [CHERRY-MX-LED]  100.01,28.57 0 top
KEY_117  CHERRY-MX-LED  [CHERRY-MX-LED]  119.06,28.57 0 top
KEY_118  CHERRY-MX-LED  [CHERRY-MX-LED]  138.11,28.57 0 top
KEY_119  CHERRY-MX-LED  [CHERRY-MX-LED]  157.16,28.57 0 top
KEY_120  CHERRY-MX-LED  [CHERRY-MX-LED]  176.21,28.57 0 top
KEY_121  CHERRY-MX-LED  [CHERRY-MX-LED]  195.26,28.57 0 top
KEY_122  CHERRY-MX-LED  [CHERRY-MX-LED]  214.31,28.57 0 top
KEY_123  CHERRY-MX-LED  [CHERRY-MX-LED]  233.36,28.57 0 top
KEY_124  CHERRY-MX-LED  [CHERRY-MX-LED]  252.41,28.57 0 top
KEY_125  CHERRY-MX-LED  [CHERRY-MX-LED]  271.46,28.57 0 top
KEY_126  CHERRY-MX-LED  [CHERRY-MX-LED]  307.18,28.57 0 top
KEY_127  CHERRY-MX-LED  [CHERRY-MX-LED]  352.43,28.57 0 top
KEY_128  CHERRY-MX-LED  [CHERRY-MX-LED]  371.48,28.57 0 top
KEY_129  CHERRY-MX-LED  [CHERRY-MX-LED]  390.52,28.57 0 top
KEY_130  CHERRY-MX-LED  [CHERRY-MX-LED]  419.1,28.57 0 top
KEY_131  CHERRY-MX-LED  [CHERRY-MX-LED]  438.15,28.57 0 top
KEY_132  CHERRY-MX-LED  [CHERRY-MX-LED]  457.2,28.57 0 top
KEY_133  CHERRY-MX-LED  [CHERRY-MX-LED]  9.53,9.53 0 top
KEY_134  CHERRY-MX-LED  [CHERRY-MX-LED]  28.57,9.53 0 top
KEY_135  CHERRY-MX-LED  [CHERRY-MX-LED]  59.53,9.53 0 top
KEY_136  CHERRY-MX-LED  [CHERRY-MX-LED]  83.34,9.53 0 top
KEY_137  CHERRY-MX-LED  [CHERRY-MX-LED]  107.16,9.53 0 top
KEY_138  CHERRY-MX-LED  [CHERRY-MX-LED]  178.59,9.53 0 top
KEY_139  CHERRY-MX-LED  [CHERRY-MX-LED]  250.03,9.53 0 top
KEY_140  CHERRY-MX-LED  [CHERRY-MX-LED]  273.84,9.53 0 top
KEY_141  CHERRY-MX-LED  [CHERRY-MX-LED]  297.66,9.53 0 top
KEY_142  CHERRY-MX-LED  [CHERRY-MX-LED]  321.47,9.53 0 top
KEY_143  CHERRY-MX-LED  [CHERRY-MX-LED]  352.43,9.53 0 top
KEY_144  CHERRY-MX-LED  [CHERRY-MX-LED]  371.48,9.53 0 top
KEY_145  CHERRY-MX-LED  [CHERRY-MX-LED]  390.52,9.53 0 top
KEY_146  CHERRY-MX-LED  [CHERRY-MX-LED]  419.1,9.53 0 top
KEY_147  CHERRY-MX-LED  [CHERRY-MX-LED]  438.15,9.53 0 top
KEY_148  CHERRY-MX-LED  [CHERRY-MX-LED]  457.2,9.53 0 top
KEY_149  CHERRY-MX-LED  [CHERRY-MX-LED]  476.25,19.05 0 top
KEY_150  CHERRY-MX-LED  [CHERRY-MX-LED]  419.1,133.35 0 top
KEY_151  CHERRY-MX-LED  [CHERRY-MX-LED]  438.15,133.35 0 top
KEY_152  CHERRY-MX-LED  [CHERRY-MX-LED]  457.2,133.35 0 top
KEY_153  CHERRY-MX-LED  [CHERRY-MX-LED]  476.25,133.35 0 top
L1  330  [78285333]  343.15,113.33 270 bottom
L2  330  [78285333]  333.89,113.83 270 bottom
R1  10k  [RESC3115X65N]  360.29,99.94 90 top
R2  33  [RESC2012X65N]  332.76,106.16 270 bottom
R3  33  [RESC2012X65N]  334.94,106.16 270 bottom
R4  210K  [RESC2012X65]  207.6,16.6 0 bottom
R5  4.7K  [RESC2012X65]  225.8,14.5 270 bottom
R6  4.7K  [RESC2012X65]  232.2,38.7 180 bottom
R7  100K  [RESC2012X65]  242.4,38.6 0 bottom
R8  100K  [RESC2012X65]  252.6,20.15 180 bottom
R9  100K  [RESC2012X65]  212.3,6.6 180 bottom
R11  10k  [RESC3115X65N]  348.93,96.56 0 top
R12  5.1k  [RESC2012X60N]  345.3,116.7 90 bottom
R13  5.1k  [RESC2012X60N]  331.8,113.6 270 bottom
SCL  TPB2,54  [B2,54]  236.1,14.7 0 top
SDA  TPB2,54  [B2,54]  231.1,14.7 0 top
SJ1  [SJ_2]  346.14,103.87 180 top
SJ2  [SJW]  4.6,123.8 90 top
SJ3  [SJW]  24.9,123.8 90 top
SJ4  [SJW]  54.77,123.83 90 top
SJ5  [SJW]  73.82,123.83 90 top
SJ6  [SJW]  92.87,123.83 90 top
SJ7  [SJW]  111.92,123.83 90 top
SJ8  [SJW]  130.97,123.83 90 top
SJ9  [SJW]  150.02,123.83 90 top
SJ10  [SJW]  169.07,123.83 90 top
SJ11  [SJW]  188.12,123.83 90 top
SJ12  [SJW]  207.17,123.83 90 top
SJ13  [SJW]  226.22,123.83 90 top
SJ14  [SJW]  245.27,123.83 90 top
SJ15  [SJW]  264.32,123.83 90 top
SJ16  [SJW]  283.37,123.83 90 top
SJ17  [SJW]  302.42,123.83 90 top
SJ18  [SJW]  321.47,123.83 90 top
SJ19  [SJW]  350.04,123.83 90 top
SJ20  [SJW]  369.09,123.83 90 top
SJ21  [SJW]  388.14,123.83 90 top
SJ22  [SJW]  415.5,123.83 90 top
SJ23  [SJW]  434.5,123.83 90 top
SJ24  [SJW]  453.5,123.83 90 top
SJ25  [SJW]  472.5,123.83 90 top
SJ26  [SJW]  47.4,139.8 0 bottom
SJ27  [SJW]  47.42,112.36 0 bottom
SJ28  [SJW]  47.42,83.34 0 bottom
SJ29  [SJW]  47.42,64.29 0 bottom
SJ30  [SJW]  47.42,45.24 0 bottom
SJ31  [SJW]  47.42,26.19 0 bottom
SJ32  [SJW]  47.42,11.91 0 bottom
SJ33  [SJW]  47.58,89.22 180 bottom
SJ34  [SJW]  47.46,98.84 180 bottom
SJ35  [SJW]  329.69,123.83 270 top
SJ36  [SJW]  408.5,137 0 bottom
SJ37  [SJW]  408.5,118 0 bottom
SJ38  [SJW]  408.49,83.34 0 bottom
SJ39  [SJW]  408.49,64.51 0 bottom
SJ40  [SJW]  408.49,45.52 0 bottom
SJ41  [SJW]  408.49,26.38 0 bottom
SJ42  [SJW]  408.39,11.62 0 bottom
SJ43  [SJW]  408.5,130.9 0 bottom
SJ44  [SJW]  408.5,127.1 0 bottom
SJ45  [SJW]  47.4,128.1 0 bottom
SJ46  [SJW]  47.4,136.1 0 bottom
SJ47  [SJW]  14.5,123.9 90 top
SJ48  [SJW]  60.2,123.8 90 top
SJ49  [SJW]  116.5,123.8 90 top
SJ50  [SJW]  136.3,123.9 90 top
SJ51  [SJW]  174.4,123.9 90 top
SJ52  [SJW]  212.6,123.8 90 top
SJ53  [SJW]  269.4,123.8 90 top
SJ54  [SJW]  307.5,123.8 90 top
SJ55  [SJW]  355.5,123.9 90 top
SJ56  [SJW]  374.8,123.9 90 top
SJ57  [SJW]  421.3,123.8 90 top
SJ58  [SJW]  459.3,123.9 90 top
SJ59  [SJW]  47.5,103 180 bottom
SJ60  [SJW]  47.4,108.3 180 bottom
SJ61  [SJW]  408.5,107.3 0 bottom
SJ62  [SJW]  408.5,112.8 0 bottom
SJ63  [SJW]  47.4,78.4 180 bottom
SJ64  [SJW]  47.4,73 180 bottom
SJ65  [SJW]  408.5,78.1 0 bottom
SJ66  [SJW]  408.5,72.3 0 bottom
SJ67  [SJW]  47.4,58.3 0 bottom
SJ68  [SJW]  47.4,52.9 0 bottom
SJ69  [SJW]  408.5,59.2 0 bottom
SJ70  [SJW]  408.5,54.8 0 bottom
SJ71  [SJW]  47.4,40.2 0 bottom
SJ72  [SJW]  47.3,35.2 0 bottom
SJ73  [SJW]  408.5,40.5 0 bottom
SJ74  [SJW]  408.5,35.5 0 bottom
SJ75  [SJW]  47.4,21.2 0 bottom
SJ76  [SJW]  47.4,15.9 0 bottom
SJ77  [SJW]  408.5,21.4 0 bottom
SJ78  [SJW]  408.4,16.4 0 bottom
SJ79  [SJW]  47.4,7.1 0 bottom
SJ80  [SJW]  47.5,3.3 0 bottom
SJ81  [SJW]  408.4,7.8 0 bottom
SJ82  [SJW]  408.5,4.15 0 bottom
SJ83  [SJW]  66.5,123.9 270 top
SJ84  [SJW]  81.7,123.9 270 top
SJ85  [SJW]  47.4,30.1 0 bottom
SJ86  [SJW]  408.4,31.5 0 bottom
SJ87  [SJW]  408.4,50.1 0 bottom
SJ_MCU_COL1  JUMPER-SMT_2_NC_TRACE_NO-SILK  [SMT-JUMPER_2_NC_TRACE_NO-SILK]  52.52,91.46 90 bottom
SJ_MCU_COL2  JUMPER-SMT_2_NC_TRACE_NO-SILK  [SMT-JUMPER_2_NC_TRACE_NO-SILK]  59.73,101.79 180 bottom
SJ_MCU_COL3  JUMPER-SMT_2_NC_TRACE_NO-SILK  [SMT-JUMPER_2_NC_TRACE_NO-SILK]  56.2,95.88 180 bottom
SJ_MCU_COL4  JUMPER-SMT_2_NC_TRACE_NO-SILK  [SMT-JUMPER_2_NC_TRACE_NO-SILK]  75.2,97.52 180 bottom
SJ_MCU_COL5  JUMPER-SMT_2_NC_TRACE_NO-SILK  [SMT-JUMPER_2_NC_TRACE_NO-SILK]  94.4,97.52 180 bottom
SJ_MCU_COL6  JUMPER-SMT_2_NC_TRACE_NO-SILK  [SMT-JUMPER_2_NC_TRACE_NO-SILK]  113.4,102.52 180 bottom
SJ_MCU_COL7  JUMPER-SMT_2_NC_TRACE_NO-SILK  [SMT-JUMPER_2_NC_TRACE_NO-SILK]  132.3,102.72 180 bottom
SJ_MCU_COL8  JUMPER-SMT_2_NC_TRACE_NO-SILK  [SMT-JUMPER_2_NC_TRACE_NO-SILK]  151.3,96.22 180 bottom
SJ_MCU_COL9  JUMPER-SMT_2_NC_TRACE_NO-SILK  [SMT-JUMPER_2_NC_TRACE_NO-SILK]  170.6,95.72 180 bottom
SJ_MCU_COL10  JUMPER-SMT_2_NC_TRACE_NO-SILK  [SMT-JUMPER_2_NC_TRACE_NO-SILK]  189.74,95.9 180 bottom
SJ_MCU_COL11  JUMPER-SMT_2_NC_TRACE_NO-SILK  [SMT-JUMPER_2_NC_TRACE_NO-SILK]  208.7,94.92 180 bottom
SJ_MCU_COL12  JUMPER-SMT_2_NC_TRACE_NO-SILK  [SMT-JUMPER_2_NC_TRACE_NO-SILK]  228.2,94.62 180 bottom
SJ_MCU_COL13  JUMPER-SMT_2_NC_TRACE_NO-SILK  [SMT-JUMPER_2_NC_TRACE_NO-SILK]  246.9,93.82 180 bottom
SJ_MCU_COL14  JUMPER-SMT_2_NC_TRACE_NO-SILK  [SMT-JUMPER_2_NC_TRACE_NO-SILK]  265.88,93.52 180 bottom
SJ_MCU_COL15  JUMPER-SMT_2_NC_TRACE_NO-SILK  [SMT-JUMPER_2_NC_TRACE_NO-SILK]  284.9,92.52 180 bottom
SJ_MCU_COL16  JUMPER-SMT_2_NC_TRACE_NO-SILK  [SMT-JUMPER_2_NC_TRACE_NO-SILK]  307.59,104.3 180 bottom
SJ_MCU_COL17  JUMPER-SMT_2_NC_TRACE_NO-SILK  [SMT-JUMPER_2_NC_TRACE_NO-SILK]  309.01,93.76 180 bottom
SJ_MCU_COL18  JUMPER-SMT_2_NC_TRACE_NO-SILK  [SMT-JUMPER_2_NC_TRACE_NO-SILK]  341.26,86.7 180 top
SJ_MCU_COL19  JUMPER-SMT_2_NC_TRACE_NO-SILK  [SMT-JUMPER_2_NC_TRACE_NO-SILK]  361.67,88.9 0 bottom
SJ_MCU_COL20  JUMPER-SMT_2_NC_TRACE_NO-SILK  [SMT-JUMPER_2_NC_TRACE_NO-SILK]  382.01,94 0 bottom
SJ_MCU_COL21  JUMPER-SMT_2_NC_TRACE_NO-SILK  [SMT-JUMPER_2_NC_TRACE_NO-SILK]  407.96,95.63 0 bottom
SJ_MCU_COL22  JUMPER-SMT_2_NC_TRACE_NO-SILK  [SMT-JUMPER_2_NC_TRACE_NO-SILK]  423.7,96.2 0 bottom
SJ_MCU_COL23  JUMPER-SMT_2_NC_TRACE_NO-SILK  [SMT-JUMPER_2_NC_TRACE_NO-SILK]  443.84,95.97 0 bottom
SJ_MCU_COL24  JUMPER-SMT_2_NC_TRACE_NO-SILK  [SMT-JUMPER_2_NC_TRACE_NO-SILK]  446.94,101.54 0 bottom
SJ_MCU_ROW1  JUMPER-SMT_2_NC_TRACE_NO-SILK  [SMT-JUMPER_2_NC_TRACE_NO-SILK]  329.64,118.93 270 top
SJ_MCU_ROW2  JUMPER-SMT_2_NC_TRACE_NO-SILK  [SMT-JUMPER_2_NC_TRACE_NO-SILK]  332.72,111.7 270 top
SJ_MCU_ROW3  JUMPER-SMT_2_NC_TRACE_NO-SILK  [SMT-JUMPER_2_NC_TRACE_NO-SILK]  327.18,76.07 90 bottom
SJ_MCU_ROW4  JUMPER-SMT_2_NC_TRACE_NO-SILK  [SMT-JUMPER_2_NC_TRACE_NO-SILK]  328.11,70.73 90 top
SJ_MCU_ROW5  JUMPER-SMT_2_NC_TRACE_NO-SILK  [SMT-JUMPER_2_NC_TRACE_NO-SILK]  328.98,46.91 90 top
SJ_MCU_ROW6  JUMPER-SMT_2_NC_TRACE_NO-SILK  [SMT-JUMPER_2_NC_TRACE_NO-SILK]  333.01,29.66 90 top
SJ_MCU_ROW7  JUMPER-SMT_2_NC_TRACE_NO-SILK  [SMT-JUMPER_2_NC_TRACE_NO-SILK]  337.93,11.33 90 top
SV1  [MA04-1]  342.49,54.93 90 bottom
SW1  1825910-7  [SW_1825910-7]  372.82,101.14 90 top
TVS1  [0603ESDA2-TR2]  338.09,112.96 270 bottom
TVS2  [0603ESDA2-TR2]  340.36,113.25 180 top
TVS3  [0603ESDA2-TR2]  335.84,113.25 0 top
U1  MK22FX512VLQ12  [LQFP-144_20X20X1.6]  333.34,92.53 270 bottom
U2  AP2115M-3.3TRG1  [SOIC127P600X175-8N]  382.5,101.4 0 top
U3  IS31FL3733B-TQLS4  [IS31FL3733B-TQLS4]  203.3,10.2 90 bottom
VDD_3V3  TPB2,54  [B2,54]  326.8,78.4 0 top
VLDO_5V  TPB2,54  [B2,54]  381.4,95.4 0 top
Y1  ABM3B-8.000MHZ-B2-T  [OSC_ABM3B-8.000MHZ-B2-T]  345.05,77.23 180 bottom
Y2  ABS07-32.768KHZ-T  [XTAL_ABS07-32.768KHZ-T]  346.34,103.83 0 bottom

## Tracks (layer width: path | path; a pad name or v marks a point on that pad's centre or on a via)
COL_1
  Bottom 0.127: SJ33.2 50.81,89.22 SJ_MCU_COL1.1
COL_1_XFUNC  (via drill 0.35)
  Top 0.127: KEY_133.SW1 6.38,12.73 6.38,30.45 KEY_113.SW1 6.38,31.78 6.38,49.5 KEY_91.SW1 6.38,50.83 6.38,68.55 KEY_68.SW1 6.38,69.88 6.38,87.6 KEY_45.SW1 4,89.98 v4,96.3 4,106.3 6.7,109 6.7,115.86 KEY_21.SW1
  Top 0.152: SJ2.1 4.6,117.95 KEY_21.SW1
  Bottom 0.127: SJ33.1 35.44,89.22 32.08,92.58 7.72,92.58 v4,96.3
COL_1_XFUNC_MACRO
  Top 0.152: KEY_1.SW1 6.49,135.11 6.49,126.96 SJ2.2
COL_1{MCU}
  Bottom 0.152: SJ_MCU_COL1.2 52.52,95.62 55.6,98.7 72.5,98.7 74,100.2 316.2,100.2 319.4,103.4 320.7,103.4 322.3,105 323.7,105 324.59,104.11 U1.1
COL_2
  Bottom 0.127: SJ34.2 51.68,101.79 SJ_MCU_COL2.1
COL_2_XFUNC  (via drill 0.35)
  Top 0.152: KEY_134.SW1 25.43,12.73 25.43,30.45 KEY_114.SW1 25.43,31.78 25.43,49.5 KEY_92.SW1 25.43,50.83 25.43,68.55 KEY_69.SW1 25.43,69.88 25.43,87.6 KEY_46.SW1 25.43,88.93 v25.43,103.28 25.43,116.18 KEY_22.SW1 24.77,122.39 SJ3.1
  Bottom 0.152: v25.43,103.28 29.86,98.84 SJ34.1
COL_2_XFUNC_MACRO
  Top 0.152: KEY_2.SW1 25.7,134.96 25.7,125.87 SJ3.2
COL_2{MCU}
  Bottom 0.152: SJ_MCU_COL2.2 65.16,106.7 77.2,106.7 83.2,100.7 315.9,100.7 319.1,103.9 320.5,103.9 322,105.4 324.1,105.4 325.09,104.41 U1.2
COL_3  (via drill 0.35)
  Top 0.127: SJ4.1 54.77,118.27 KEY_23.SW1 54,116.18 v54,95.25 54,88.93 KEY_47.SW1 54,87.6 54,73.32 KEY_70.SW1 58.76,68.55 58.76,51.88 KEY_93.SW1 61.15,49.5 61.15,35.22 KEY_115.SW1 65.91,30.45 65.91,22.25 KEY_135.SW1
  Bottom 0.127: v54,95.25 54.63,95.88 SJ_MCU_COL3.1
COL_3_MACRO
  Top 0.152: KEY_3.SW1 54.5,134.73 54.5,132.2 53.1,130.8 53.1,126.76 SJ4.2
COL_3{MCU}
  Bottom 0.152: SJ_MCU_COL3.2 58.88,95.88 61.2,98.2 73.1,98.2 74.7,99.8 316.7,99.8 318.05,101.15 U1.144
COL_4  (via drill 0.35)
  Top 0.127: SJ5.1 73.82,118.27 KEY_24.SW1 73.05,116.18 v73.05,95.25 73.05,88.93 KEY_48.SW1 73.05,87.6 73.05,78.08 KEY_71.SW1 82.58,68.55 82.58,54.27 KEY_94.SW1 87.34,49.5 87.34,39.98 KEY_116.SW1 96.86,30.45 96.86,27.81 85.72,16.67 83.34,16.67 79.53,12.86 KEY_136.SW1
  Bottom 0.127: v73.05,95.25 74.68,96.88 SJ_MCU_COL4.1
COL_4_MACRO
  Top 0.127: KEY_4.SW1 72.39,135.75 73.06,135.09 73.06,125.86 SJ5.2
COL_4{MCU}
  Bottom 0.152: SJ_MCU_COL4.2 77.5,99.3 317,99.3 318.35,100.65 U1.143
COL_5  (via drill 0.35)
  Top 0.127: SJ6.1 92.87,118.27 KEY_25.SW1 92.1,116.18 v92.1,95.25 92.1,88.93 KEY_49.SW1 91.44,86.63 91.71,86.36 91.71,78.47 KEY_72.SW1 | KEY_95.SW1 106.39,49.5 106.39,40.59 115.25,31.72 KEY_117.SW1
  Top 0.152: KEY_72.SW1 102,68.18 102,59.5 100.9,58.4 100.9,54.99 KEY_95.SW1 | KEY_117.SW1 116.2,30.17 116.2,21.9 113,18.7 109.98,18.7 KEY_137.SW1
  Bottom 0.127: v92.1,95.25 93.88,97.03 SJ_MCU_COL5.1
COL_5_MACRO
  Top 0.127: KEY_5.SW1 92.1,135.23 92.1,125.86 SJ6.2
COL_5{MCU}
  Bottom 0.152: SJ_MCU_COL5.2 96.1,98.7 317.1,98.7 318.55,100.15 U1.142
COL_6  (via drill 0.35)
  Top 0.127: SJ7.1 111.92,118.27 KEY_26.SW1 111.15,116.18 v111.15,104.78 111.15,88.93 KEY_50.SW1 111.15,87.6 111.15,78.08 KEY_73.SW1 120.68,68.55 120.68,54.27 KEY_96.SW1 125.44,49.5 125.44,39.98 KEY_118.SW1
  Bottom 0.127: v111.15,104.78 112.88,103.05 SJ_MCU_COL6.1
COL_6_MACRO
  Top 0.127: KEY_6.SW1 111.15,135.23 111.15,125.86 SJ7.2
COL_6{MCU}
  Bottom 0.152: SJ_MCU_COL6.2 114.48,102.52 115.8,101.2 315.5,101.2 318.7,104.4 320.3,104.4 321.7,105.8 324.5,105.8 325.59,104.71 U1.3
COL_7  (via drill 0.35)
  Top 0.127: KEY_119.SW1 144.49,39.98 144.49,49.5 KEY_97.SW1 139.73,54.27 139.73,68.55 KEY_74.SW1 130.2,78.08 130.2,87.6 KEY_51.SW1 130.2,88.93 v130.2,104.78 130.2,116.18 KEY_27.SW1 129.54,121.13 SJ8.1
  Bottom 0.127: v130.2,104.78 131.78,103.2 SJ_MCU_COL7.1
COL_7_MACRO
  Top 0.127: KEY_7.SW1 130.2,135.23 130.2,125.86 SJ8.2
COL_7{MCU}
  Bottom 0.152: SJ_MCU_COL7.2 133.78,102.72 134.7,101.8 315.2,101.8 318.4,105 320.1,105 321.5,106.4 324.8,106.4 326.09,105.11 U1.4
COL_8  (via drill 0.35)
  Top 0.127: SJ9.1 150.02,118.27 KEY_28.SW1 149.25,116.18 v149.25,95.25 149.25,88.93 KEY_52.SW1 148.59,86.63 148.86,86.36 148.86,78.47 KEY_75.SW1 158.78,68.55 158.78,54.27 KEY_98.SW1 163.54,49.5 163.54,39.98 KEY_120.SW1 173.06,30.45 173.06,13.78 KEY_138.SW1
  Bottom 0.127: v149.25,95.25 150.22,96.22 SJ_MCU_COL8.1
COL_8_MACRO
  Top 0.127: KEY_8.SW1 149.25,135.23 149.25,125.86 SJ9.2
COL_8{MCU}
  Bottom 0.152: SJ_MCU_COL8.2 153.8,98.2 317.3,98.2 318.75,99.65 U1.141
COL_9  (via drill 0.35)
  Top 0.127: SJ10.1 169.07,118.27 KEY_29.SW1 168.3,116.18 v168.3,95.25 168.3,88.93 KEY_53.SW1 168.3,87.6 168.3,78.08 KEY_76.SW1 177.83,68.55 177.83,54.27 KEY_99.SW1 182.59,49.5 182.59,39.98 KEY_121.SW1
  Bottom 0.127: v168.3,95.25 168.77,95.72 SJ_MCU_COL9.1
COL_9_MACRO
  Top 0.127: KEY_9.SW1 168.3,135.23 168.3,125.86 SJ10.2
COL_9{MCU}
  Bottom 0.152: SJ_MCU_COL9.2 173.2,97.8 317.6,97.8 318.95,99.15 U1.140
COL_10  (via drill 0.35)
  Top 0.127: SJ11.1 188.12,118.27 KEY_30.SW1 | KEY_30.SW1 187.35,116.18 v187.35,95.25 187.35,88.93 KEY_54.SW1 187.35,87.6 187.35,78.08 KEY_77.SW1 196.88,68.55 196.88,54.27 KEY_100.SW1 201.64,49.5 201.64,39.98 KEY_122.SW1 | KEY_30.SW1 182.85,116.84 182.27,117.42 179.68,117.42 179.1,116.84 KEY_30_OFFSET.SW1
  Bottom 0.127: v187.35,95.25 188,95.9 SJ_MCU_COL10.1
COL_10_MACRO
  Top 0.127: KEY_10.SW1 187.35,135.23 187.35,125.86 SJ11.2
COL_10{MCU}
  Bottom 0.152: SJ_MCU_COL10.2 191.66,97.3 317.8,97.3 319.15,98.65 U1.139
COL_11  (via drill 0.35)
  Top 0.127: SJ12.1 207.17,118.27 KEY_31.SW1 | KEY_31.SW1 206.4,116.18 v206.4,94 206.4,88.93 KEY_55.SW1 206.4,87.6 206.4,78.08 KEY_78.SW1 215.93,68.55 215.93,54.27 KEY_101.SW1 220.69,49.5 220.69,39.98 KEY_123.SW1 | KEY_31_OFFSET.SW1 198.15,116.84 198.73,117.42 201.32,117.42 201.9,116.84 KEY_31.SW1
  Bottom 0.127: SJ_MCU_COL11.1 208.16,94.9 207.1,94.9 206.4,94.2 v206.4,94
COL_11_MACRO
  Top 0.127: KEY_11.SW1 206.4,135.23 206.4,125.86 SJ12.2
COL_11{MCU}
  Bottom 0.152: SJ_MCU_COL11.2 211.1,96.8 318,96.8 319.35,98.15 U1.138
COL_12  (via drill 0.35)
  Top 0.127: SJ13.1 226.22,118.27 KEY_32.SW1 | KEY_32.SW1 225.45,116.18 v225.45,92.87 225.45,88.93 KEY_56.SW1 225.45,87.6 225.45,78.08 KEY_79.SW1 234.98,68.55 234.98,54.27 KEY_102.SW1 239.74,49.5 239.74,39.98 KEY_124.SW1 249.26,30.45 | KEY_32_OFFSET.SW1 217.2,116.84 217.78,117.42 220.37,117.42 220.95,116.84 KEY_32.SW1
  Top 0.152: KEY_139.SW1 246.22,18.92 249.26,21.96 249.26,30.45
  Bottom 0.127: v225.45,92.87 227.2,94.62 SJ_MCU_COL12.1
COL_12_MACRO
  Top 0.127: KEY_12.SW1 225.45,135.23 225.45,125.86 SJ13.2
COL_12{MCU}
  Bottom 0.152: SJ_MCU_COL12.2 230.5,96.4 318.3,96.4 319.55,97.65 U1.137
COL_13  (via drill 0.35)
  Top 0.127: SJ14.1 245.27,118.27 KEY_33.SW1 | KEY_33.SW1 244.5,116.18 v244.5,92.87 244.5,88.93 KEY_57.SW1 244.5,87.6 244.5,78.08 KEY_80.SW1 254.03,68.55 254.03,54.27 KEY_103.SW1 | KEY_125.SW1 268.31,30.45 268.31,13.78 KEY_140.SW1 | KEY_33.SW1 240,116.84 239.42,117.42 236.83,117.42 236.25,116.84 KEY_33_OFFSET.SW1
  Top 0.152: KEY_125.SW1 267.65,39.55 266.7,40.5 260.6,40.5 259.3,41.8 259.3,48.99 KEY_103.SW1
  Bottom 0.127: v244.5,92.87 245.45,93.82 SJ_MCU_COL13.1
COL_13_MACRO
  Top 0.127: KEY_13.SW1 244.5,135.23 244.5,125.86 SJ14.2
COL_13{MCU}
  Bottom 0.152: SJ_MCU_COL13.2 249.6,96 318.6,96 319.75,97.15 U1.136
COL_14  (via drill 0.35)
  Top 0.127: SJ15.1 264.32,118.27 KEY_34.SW1 263.55,116.18 v263.55,92.87 263.55,88.93 KEY_58.SW1 263.55,87.6 263.55,78.08 KEY_81.SW1 273.08,68.55 273.08,54.27 KEY_104.SW1 277.84,49.5 277.84,41.25 281.09,38 284,38 290.5,31.5 290.5,15.41 KEY_141.SW1
  Bottom 0.127: v263.55,92.87 264.2,93.52 SJ_MCU_COL14.1
COL_14_MACRO
  Top 0.127: KEY_14.SW1 263.55,135.23 263.55,125.86 SJ15.2
COL_14{MCU}
  Bottom 0.152: SJ_MCU_COL14.2 268.28,95.4 318.8,95.4 319.05,95.65 U1.133
COL_15  (via drill 0.35)
  Top 0.127: SJ16.1 283.37,118.27 KEY_35.SW1 282.6,116.18 v282.6,90.49 282.6,88.93 KEY_59.SW1 282.6,87.6 282.6,78.08 KEY_82.SW1
  Bottom 0.127: v282.6,90.49 284.38,92.27 SJ_MCU_COL15.1
COL_15_MACRO
  Top 0.127: KEY_15.SW1 282.6,135.23 282.6,125.86 SJ16.2
COL_15{MCU}
  Bottom 0.152: SJ_MCU_COL15.2 287.8,94.9 318.9,94.9 319.15,95.15 U1.132
COL_16  (via drill 0.35)
  Top 0.127: SJ17.1 302.42,118.27 KEY_36.SW1
  Top 0.152: v300.1,105.1 300.1,111.61 301.3,112.81 301.3,116.53 KEY_36.SW1
  Bottom 0.152: v300.1,105.1 300.9,104.3 SJ_MCU_COL16.1
COL_16_MACRO
  Top 0.127: KEY_16.SW1 301.65,135.23 301.65,125.86 SJ17.2
COL_16{MCU}
  Bottom 0.152: SJ_MCU_COL16.2 309.31,105.5 319.9,105.5 321.3,106.9 325.6,106.9 327.59,104.91 U1.7
COL_17  (via drill 0.35)
  Top 0.127: SJ18.1 321.47,118.27 KEY_37.SW1 | KEY_60.SW1 311.18,87.6 311.18,73.32 KEY_83.SW1 315.94,68.55 | KEY_105.SW1 308.8,49.5 308.8,36.54 KEY_126.SW1 304.03,30.45 304.03,22.2 314.17,12.06 KEY_142.SW1
  Top 0.152: KEY_37.SW1 320.7,116.18 320.7,111.9 311.5,102.7 311.5,89.25 KEY_60.SW1 308.33,88.27 306.3,90.3 306.3,92.7 v307.1,93.5 | KEY_105.SW1 313.7,55.73 313.7,58.5 315.94,60.74 315.94,68.55
  Bottom 0.152: SJ_MCU_COL17.1 307.36,93.76 v307.1,93.5
COL_17_MACRO
  Top 0.127: KEY_17.SW1 320.7,135.23 320.7,125.86 SJ18.2
COL_17{MCU}
  Bottom 0.152: SJ_MCU_COL17.2 310.06,94.3 318.9,94.3 319.25,94.65 U1.131
COL_18
  Top 0.127: KEY_143.SW1 349.28,12.73 349.28,30.45 KEY_127.SW1 349.28,31.78 349.28,49.5 KEY_106.SW1 | SJ19.1 350.04,118.27 KEY_38.SW1 349.3,116.15 349.3,113.01 352.4,109.91 352.4,105.8 354.8,103.4 354.8,96.6 352.9,94.7 352.9,92.55 351.84,91.49 351.82,91.49 KEY_61.SW1
  Top 0.152: KEY_106.SW1 349.4,50.95 349.4,68.43 KEY_84.SW1 352.4,73 352.4,75.3 349.5,78.2 349.5,87.38 KEY_61.SW1 | SJ_MCU_COL18.1 345.3,86.7 346.88,88.28 KEY_61.SW1
COL_18_MACRO
  Top 0.127: KEY_18.SW1 349.28,135.23 349.28,125.86 SJ19.2
COL_18{MCU}  (via drill 0.35)
  Top 0.152: v341.2,88.1 340.74,87.64 SJ_MCU_COL18.2
  Bottom 0.152: U1.66 342.65,86.65 v341.2,88.1
COL_19  (via drill 0.35)
  Top 0.127: SJ20.1 369.09,118.27 KEY_39.SW1 368.25,116.25 368.25,109.05 371.8,105.5 371.8,94 368.33,90.53 v368.33,90.49 368.33,88.93 KEY_62.SW1 368.33,87.6 368.33,69.88 KEY_85.SW1 368.33,68.55 368.33,50.83 KEY_107.SW1 368.33,49.5 368.33,31.78 KEY_128.SW1 368.33,30.45 368.33,12.73 KEY_144.SW1
  Bottom 0.127: v368.33,90.49 363.78,90.49 SJ_MCU_COL19.1
COL_19_MACRO
  Top 0.127: KEY_19.SW1 368.33,135.23 368.33,125.86 SJ20.2
COL_19{MCU}
  Bottom 0.152: SJ_MCU_COL19.2 359.5,87.25 359.5,85.3 358.4,84.2 355.2,84.2 353.8,82.8 351.5,82.8 350.2,84.1 346.4,84.1 345.8,84.7 345.8,87 345.15,87.65 U1.64
COL_20  (via drill 0.35)
  Top 0.127: KEY_145.SW1 387.38,12.73 387.38,30.45 KEY_129.SW1 387.38,31.78 387.38,49.5 KEY_108.SW1 387.38,50.83 387.38,68.55 KEY_86.SW1 387.38,69.88 387.38,87.6 KEY_63.SW1 387.38,88.93 387.38,92.8 v387.38,92.87
  Top 0.152: 387.38,92.8 390.5,95.92 390.5,103.3 387.5,106.3 387.5,116.06 KEY_40.SW1 388.14,118.27 SJ21.1
  Bottom 0.127: SJ_MCU_COL20.1 383.66,92.87 v387.38,92.87
COL_20_MACRO
  Top 0.127: SJ21.2 388.14,125.39 387.38,126.15 387.38,135.23 KEY_20.SW1
COL_20{MCU}
  Bottom 0.152: U1.59 346.05,90.15 347,91.1 350.6,91.1 354.2,87.5 358.3,87.5 364.8,94 SJ_MCU_COL20.2
COL_21
  Top 0.127: KEY_146.SW1 415.98,12.75 415.98,30.43 KEY_130.SW1 415.98,31.8 415.98,49.48 KEY_109.SW1 415.98,50.85 415.98,68.53 KEY_87.SW1 415.98,69.9 415.98,87.58 KEY_64.SW1 415.29,111.89 415.9,112.5 415.9,116.23 415.31,116.81 | KEY_41.SW1 415.31,116.81 | SJ22.1 415.5,117 415.31,116.81
  Bottom 0.127: KEY_64.SW1 408.48,95.08 SJ_MCU_COL21.1
COL_21_MACRO
  Top 0.127: SJ22.2 415.5,135.68 KEY_150.SW1
COL_21{MCU}
  Bottom 0.127: SJ_MCU_COL21.2 404.68,98.38 391.72,98.38 390.6,99.5 369.4,99.5 366.2,96.3
  Bottom 0.152: U1.58 345.85,90.65 346.8,91.6 350.9,91.6 354.4,88.1 358,88.1 366.2,96.3
COL_22
  Top 0.127: KEY_147.SW1 435.03,12.75 435.03,30.43 KEY_131.SW1 435.03,31.8 435.03,48.37 434.34,49.05 KEY_110.SW1 435.03,50.85 435.03,68.53 KEY_88.SW1 435.03,69.9 435.03,87.58 KEY_65.SW1 434,88.61 434,112.2 435.03,113.23 435.03,116.19 434.37,116.84 KEY_42.SW1 434.5,117 SJ23.1
  Bottom 0.127: KEY_65.SW1 426.4,96.2 SJ_MCU_COL22.1
COL_22_MACRO
  Top 0.152: KEY_151.SW1 435.5,134.73 435.5,126.09 SJ23.2
COL_22{MCU}
  Bottom 0.127: SJ_MCU_COL22.2 416.9,96.2 413.8,99.3 392,99.3 391.21,100.09 368.83,100.09 365.68,96.95
  Bottom 0.152: 365.68,96.95 361.44,92.7 352.4,92.7 351.85,92.15 U1.55
COL_23  (via drill 0.35)
  Top 0.127: KEY_66.SW1 454.08,87.58 454.08,69.9 KEY_89.SW1 454.08,68.53 454.08,50.85 KEY_111.SW1 454.08,49.48 454.08,31.8 KEY_132.SW1 454.08,30.43 454.08,12.75 KEY_148.SW1 | v445.73,95.93 445.85,95.93 448.5,98.58 448.5,103 454.08,108.58 454.08,114.49 453.39,115.17 KEY_43.SW1 453.5,116.95 SJ24.1
  Bottom 0.127: KEY_66.SW1 v445.73,95.93 445.68,95.97 SJ_MCU_COL23.1
COL_23_MACRO
  Top 0.152: KEY_152.SW1 454.3,134.98 454.3,128.5 453.5,127.7 SJ24.2
COL_23{MCU}
  Bottom 0.127: SJ_MCU_COL23.2 438.59,100.7 408,100.7 406.3,102.4 369.6,102.4 367.5,104.5 355.9,104.5 352.65,101.25
  Bottom 0.152: 352.65,101.25 352.65,99.55 354.6,97.6 354.6,96.4 353.85,95.65 U1.48
COL_24  (via drill 0.35)
  Top 0.127: KEY_149.SW1 473.13,22.28 473.13,49.48 KEY_112.SW1 473.13,50.85 473.13,68.53 KEY_90.SW1 473.13,69.9 473.13,87.58 KEY_67.SW1 470.5,90.2 467.5,90.2 v463.5,94.2 469.3,94.2 473.13,98.03 473.13,114.49 472.44,115.17 KEY_44.SW1 472.5,116.9 SJ25.1
  Bottom 0.127: SJ_MCU_COL24.1 456.16,101.54 v463.5,94.2
COL_24_MACRO
  Top 0.127: SJ25.2 472.5,131.97 473.19,132.66 473.19,135.14 KEY_153.SW1
COL_24{MCU}
  Bottom 0.127: SJ_MCU_COL24.2 408.26,101.54 406.3,103.5 389.3,103.5 388.6,102.8 370.2,102.8 367.91,105.08 355.79,105.08
  Bottom 0.152: 355.79,105.08 355.49,105.08 351.9,101.5 351.9,99.6 354,97.5 354,96.5 353.65,96.15 U1.47
EXTAL
  Bottom 0.152: Y1.3 346.42,79.4 347.5,79.4 348,79.9 348,81.7 347.35,82.35 C11.2 345.55,82.35 345.2,82.7 345.2,83.2 344.75,83.65 U1.72
EXTAL32
  Bottom 0.127: U1.41 345.95,99.15 347.69,100.89 Y2.1
  Bottom 0.152: C24.1 Y2.1
FTM3_CH4  (via drill 0.35)
  Top 0.152: J3.7 297.25,100.65 293.8,97.2 v293.8,93.4
  Bottom 0.152: U1.113 321.96,85.65 320.21,87.4 318,87.4 317.35,88.05 314.45,88.05 312.5,90 297.2,90 v293.8,93.4
GND  (via drill 0.35, 4.5)
  Top 0.127: SW1.4 SW1.3 | 334.94,113.3 TVS3.1
  Top 0.152: C6.1 330.93,95.75 C12.2 | C7.1 C2.2 | v220,13.3 222.5,10.8 GND1.TP | GND2.TP 397,101.3 v397.3,101 | J3.2 304.25,98.15 305.6,99.5 v305.6,102.9
  Top 0.254: C7.1 329.72,92.44 329.76,92.4 v332.2,92.4 | 335.88,91.5 C5.1 | 335.88,91.5 C1.2 333.62,84.83 v333.3,84.5 | v332.2,92.4 332.25,92.45 332.01,92.69 C12.2 | v332.2,92.4 334.98,92.4 335.88,91.5 | U2.7 383.33,102.03 v382.8,101.5 383.54,100.77 U2.6 | v352.4,97.3 353,96.7 353,95.8 351.25,94.05 C15.2 | C14.2 349.59,99.8 v348.6,99.8
  Top 0.508: J1.A1_B12 341.34,116.26 342.2,115.4 342.2,114.04 341.41,113.25 TVS2.1 341.21,112.31 v340.2,111.3 | TVS3.1 334.99,111.39 v334.3,110.7 | J1.B1_A12 334.94,116.14 334.2,115.4 334.2,114.04 334.94,113.3
  Bottom 0.127: 334.01,112.4 L2.2 | C24.2 C25.2 344.18,107.97 341.09,104.89 U1.34